# Altium schematic sheet MotorController.SchDoc
size A3
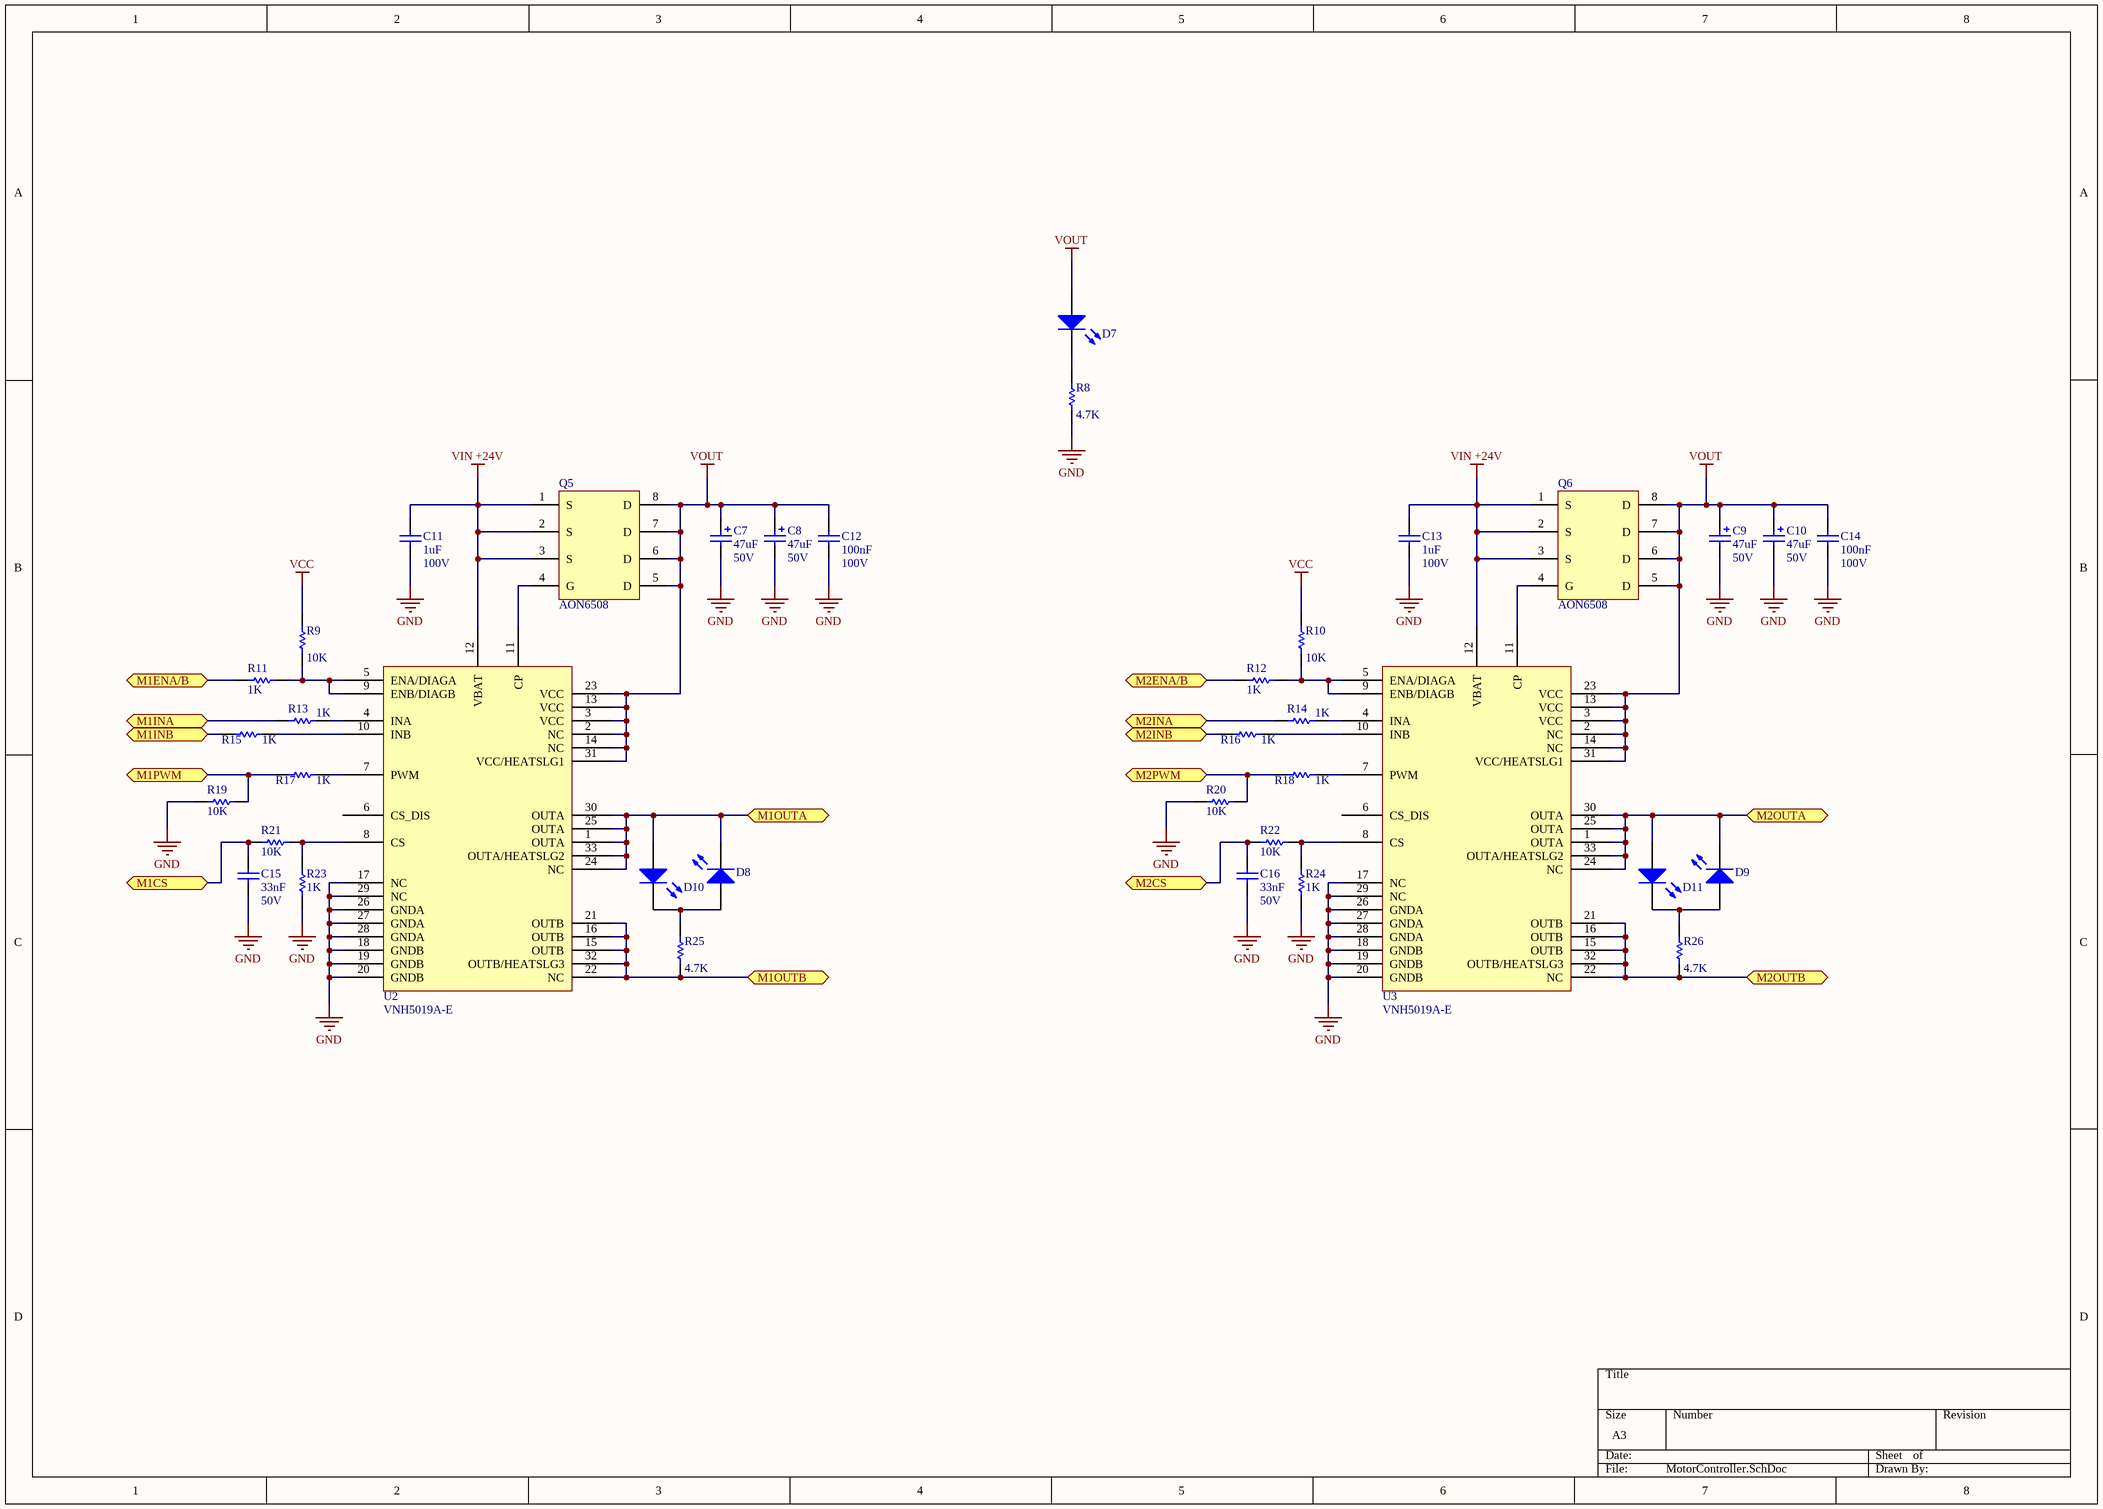
[diagram p0: MotorController.SchDoc]

## Parts
C7  value 47uF  Voltage: 50V  [CAP D Size]  (hidden comment: Cap Pol1)
C8  value 47uF  Voltage: 50V  [CAP D Size]  (hidden comment: Cap Pol1)
C9  value 47uF  Voltage: 50V  [CAP D Size]  (hidden comment: Cap Pol1)
C10  value 47uF  Voltage: 50V  [CAP D Size]  (hidden comment: Cap Pol1)
C11  value 1uF  Voltage: 100V  [8-1206]  (hidden comment: Cap)
C12  value 100nF  Voltage: 100V  [6-0805 - big]  (hidden comment: Cap)
C13  value 1uF  Voltage: 100V  [8-1206]  (hidden comment: Cap)
C14  value 100nF  Voltage: 100V  [6-0805 - big]  (hidden comment: Cap)
C15  value 33nF  Voltage: 50V  [3-0603_L]  (hidden comment: Cap)
C16  value 33nF  Voltage: 50V  [3-0603_L]  (hidden comment: Cap)
D7  LED  [6-0805 - LED]  (value not drawn)
D8  LED  [6-0805 - LED]  (value not drawn)
D9  LED  [6-0805 - LED]  (value not drawn)
D10  LED  [6-0805 - LED]  (value not drawn)
D11  LED  [6-0805 - LED]  (value not drawn)
Q5  AON6508  [DFN5x6 EP]
Q6  AON6508  [DFN5x6 EP]
R8  value 4.7K  [3-0603_L]  (hidden comment: Res1)
R9  value 10K  [3-0603_L]  (hidden comment: Res1)
R10  value 10K  [3-0603_L]  (hidden comment: Res1)
R11  value 1K  [3-0603_L]  (hidden comment: Res1)
R12  value 1K  [3-0603_L]  (hidden comment: Res1)
R13  value 1K  [3-0603_L]  (hidden comment: Res1)
R14  value 1K  [3-0603_L]  (hidden comment: Res1)
R15  value 1K  [3-0603_L]  (hidden comment: Res1)
R16  value 1K  [3-0603_L]  (hidden comment: Res1)
R17  value 1K  [3-0603_L]  (hidden comment: Res1)
R18  value 1K  [3-0603_L]  (hidden comment: Res1)
R19  value 10K  [3-0603_L]  (hidden comment: Res1)
R20  value 10K  [3-0603_L]  (hidden comment: Res1)
R21  value 10K  [3-0603_L]  (hidden comment: Res1)
R22  value 10K  [3-0603_L]  (hidden comment: Res1)
R23  value 1K  [3-0603_L]  (hidden comment: Res1)
R24  value 1K  [3-0603_L]  (hidden comment: Res1)
R25  value 4.7K  [3-0603_L]  (hidden comment: Res1)
R26  value 4.7K  [3-0603_L]  (hidden comment: Res1)
U2  VNH5019A-E  [MultiPowerSO-30]
U3  VNH5019A-E  [MultiPowerSO-30]

## Ports
M1CS, M1ENA/B, M1INA, M1INB, M1OUTA, M1OUTB, M1PWM, M2CS, M2ENA/B, M2INA, M2INB, M2OUTA, M2OUTB, M2PWM

## Nets
GND: C7.2 C8.2 C9.2 C10.2 C11.1 C12.1 C13.1 C14.1 C15.1 C16.1 R8.1 R19.1 R20.1 R23.1 R24.1 U2.17(NC) U2.18(GNDB) U2.19(GNDB) U2.20(GNDB) U2.26(GNDA) U2.27(GNDA) U2.28(GNDA) U2.29(NC) U3.17(NC) U3.18(GNDB) U3.19(GNDB) U3.20(GNDB) U3.26(GNDA) U3.27(GNDA) U3.28(GNDA) U3.29(NC)
VCC: R9.2 R10.2
VIN +24V: C11.2 C13.2 Q5.1(S) Q5.2(S) Q5.3(S) Q6.1(S) Q6.2(S) Q6.3(S) U2.12(VBAT) U3.12(VBAT)
VOUT: C7.1 C8.1 C9.1 C10.1 C12.2 C14.2 D7.1(A) Q5.5(D) Q5.6(D) Q5.7(D) Q5.8(D) Q6.5(D) Q6.6(D) Q6.7(D) Q6.8(D) U2.2(NC) U2.3(VCC) U2.13(VCC) U2.14(NC) U2.23(VCC) U2.31(VCC/HEATSLG1) U3.2(NC) U3.3(VCC) U3.13(VCC) U3.14(NC) U3.23(VCC) U3.31(VCC/HEATSLG1)
M1CS: C15.2 R21.2 ; port M1CS
M1ENA/B: R11.1 ; port M1ENA/B
M1INA: R13.1 ; port M1INA
M1INB: R15.1 ; port M1INB
M1OUTA: D8.2(K) D10.1(A) U2.1(OUTA) U2.24(NC) U2.25(OUTA) U2.30(OUTA) U2.33(OUTA/HEATSLG2) ; port M1OUTA
M1OUTB: R25.1 U2.15(OUTB) U2.16(OUTB) U2.21(OUTB) U2.22(NC) U2.32(OUTB/HEATSLG3) ; port M1OUTB
M1PWM: R17.1 R19.2 ; port M1PWM
M2CS: C16.2 R22.2 ; port M2CS
M2ENA/B: R12.1 ; port M2ENA/B
M2INA: R14.1 ; port M2INA
M2INB: R16.1 ; port M2INB
M2OUTA: D9.2(K) D11.1(A) U3.1(OUTA) U3.24(NC) U3.25(OUTA) U3.30(OUTA) U3.33(OUTA/HEATSLG2) ; port M2OUTA
M2OUTB: R26.1 U3.15(OUTB) U3.16(OUTB) U3.21(OUTB) U3.22(NC) U3.32(OUTB/HEATSLG3) ; port M2OUTB
M2PWM: R18.1 R20.2 ; port M2PWM
NetD7_2: D7.2(K) R8.2
NetD8_1: D8.1(A) D10.2(K) R25.2
NetD9_1: D9.1(A) D11.2(K) R26.2
NetQ5_4: Q5.4(G) U2.11(CP)
NetQ6_4: Q6.4(G) U3.11(CP)
NetR9_1: R9.1 R11.2 U2.5(ENA/DIAGA) U2.9(ENB/DIAGB)
NetR10_1: R10.1 R12.2 U3.5(ENA/DIAGA) U3.9(ENB/DIAGB)
NetR13_2: R13.2 U2.4(INA)
NetR14_2: R14.2 U3.4(INA)
NetR15_2: R15.2 U2.10(INB)
NetR16_2: R16.2 U3.10(INB)
NetR17_2: R17.2 U2.7(PWM)
NetR18_2: R18.2 U3.7(PWM)
NetR21_1: R21.1 R23.2 U2.8(CS)
NetR22_1: R22.1 R24.2 U3.8(CS)

Not connected (* = marked no-connect by the designer): U2 6(CS_DIS); U3 6(CS_DIS)

## Library data of the parts
C7-C10 = Cap Pol1: Polarized Capacitor (Radial); Published: 8-Jun-2000; Revision: July-2002: Re-released for DXP Platform.; Publisher: Altium Limited
C11-C16 = Cap: Capacitor; Published: 8-Jun-2000; Revision: July-2002: Re-released for DXP Platform.; Publisher: Altium Limited
D7-D11 = LED: Typical INFRARED GaAs LED; Published: 8-Jun-2000; LatestRevisionDate: 08-Jul-2005; LatestRevisionNote: Mech Layer 1 removed.; PackageReference: LED-0; Publisher: Altium Limited
Q5 Q6 = AON6508: 30V N-Channel AlphaMOS; Published: 29-Jan-2009; DatasheetVersion: revE, Mar-2007; PackageVersion: revAW, Oct-2008; Publisher: Altium Limited; ComponentLink3Description: Packaging Specification
R8-R26 = Res1: Resistor; Published: 8-Jun-2000; LatestRevisionDate: 17-Jul-2002; LatestRevisionNote: Re-released for DXP Platform.; PackageReference: AXIAL-0.3; Publisher: Altium Limited
U2 U3 = VNH5019A-E: Automotive fully integrated H-bridge motor driver; PackageVersion: revAW, Oct-2008; Publisher: Altium Limited; ComponentLink2Description: Datasheet